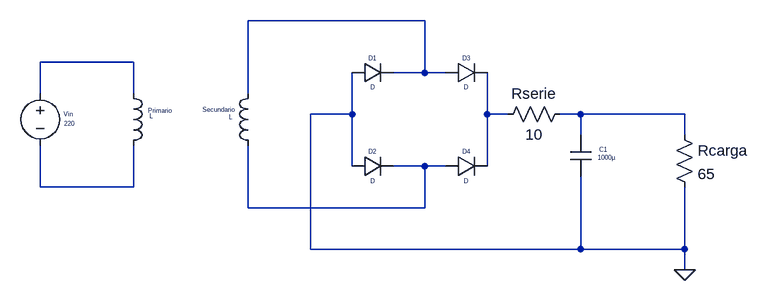
[diagram p0: schematic RcargaSeriesEquivalente.asc]
RcargaSeriesEquivalente.asc, the LTspice schematic file:
Version 4
SHEET 1 1016 680
WIRE 464 32 192 32
WIRE 16 96 -128 96
WIRE 464 112 464 32
WIRE 464 112 416 112
WIRE 496 112 464 112
WIRE -128 144 -128 96
WIRE 16 144 16 96
WIRE 192 144 192 32
WIRE 352 176 352 112
WIRE 352 176 288 176
WIRE 560 176 560 112
WIRE 592 176 560 176
WIRE 704 176 672 176
WIRE 864 176 704 176
WIRE 704 208 704 176
WIRE 864 208 864 176
WIRE 352 256 352 176
WIRE 464 256 416 256
WIRE 496 256 464 256
WIRE 560 256 560 176
WIRE -128 288 -128 224
WIRE 16 288 16 224
WIRE 16 288 -128 288
WIRE 192 320 192 224
WIRE 464 320 464 256
WIRE 464 320 192 320
WIRE 288 384 288 176
WIRE 704 384 704 272
WIRE 704 384 288 384
WIRE 864 384 864 288
WIRE 864 384 704 384
WIRE 864 416 864 384
FLAG 864 416 0
SYMBOL ind 208 240 R180
WINDOW 0 35 71 Left 0
WINDOW 3 40 60 Left 0
SYMATTR InstName Secundario
SYMBOL ind 0 128 R0
WINDOW 0 38 42 Left 0
WINDOW 3 40 51 Left 0
SYMATTR InstName Primario
SYMBOL diode 352 128 R270
WINDOW 0 32 32 VTop 0
WINDOW 3 0 32 VBottom 0
SYMATTR InstName D1
SYMBOL diode 352 272 R270
WINDOW 0 32 32 VTop 0
WINDOW 3 0 32 VBottom 0
SYMATTR InstName D2
SYMBOL diode 496 128 R270
WINDOW 0 32 32 VTop 0
WINDOW 3 0 32 VBottom 0
SYMATTR InstName D3
SYMBOL diode 496 272 R270
WINDOW 0 32 32 VTop 0
WINDOW 3 0 32 VBottom 0
SYMATTR InstName D4
SYMBOL cap 688 208 R0
WINDOW 0 45 22 Left 0
WINDOW 3 42 35 Left 0
SYMATTR InstName C1
SYMATTR Value 1000µ
SYMBOL res 848 192 R0
SYMATTR InstName Rcarga
SYMATTR Value 65
SYMBOL voltage -128 128 R0
WINDOW 0 36 48 Left 0
WINDOW 3 37 62 Left 0
SYMATTR InstName Vin
SYMATTR Value 220
SYMBOL res 688 160 R90
WINDOW 0 0 56 VBottom 2
WINDOW 3 32 56 VTop 2
SYMATTR InstName Rserie
SYMATTR Value 10

The netlist it stands for:
* RcargaSeriesEquivalente.asc
L§Secundario N005 N001 L
L§Primario N002 N006 L
D1 0 N001 D
D2 0 N005 D
D3 N001 N003 D
D4 N005 N003 D
C1 N004 0 1000µ
Rcarga N004 0 65
Vin N002 N006 220
Rserie N004 N003 10
.model D D
.lib standard.dio
.backanno
.end